# Altium schematic sheet BLOCK6.SchDoc
size A3; SheetNumber: 6; SheetTotal: 12
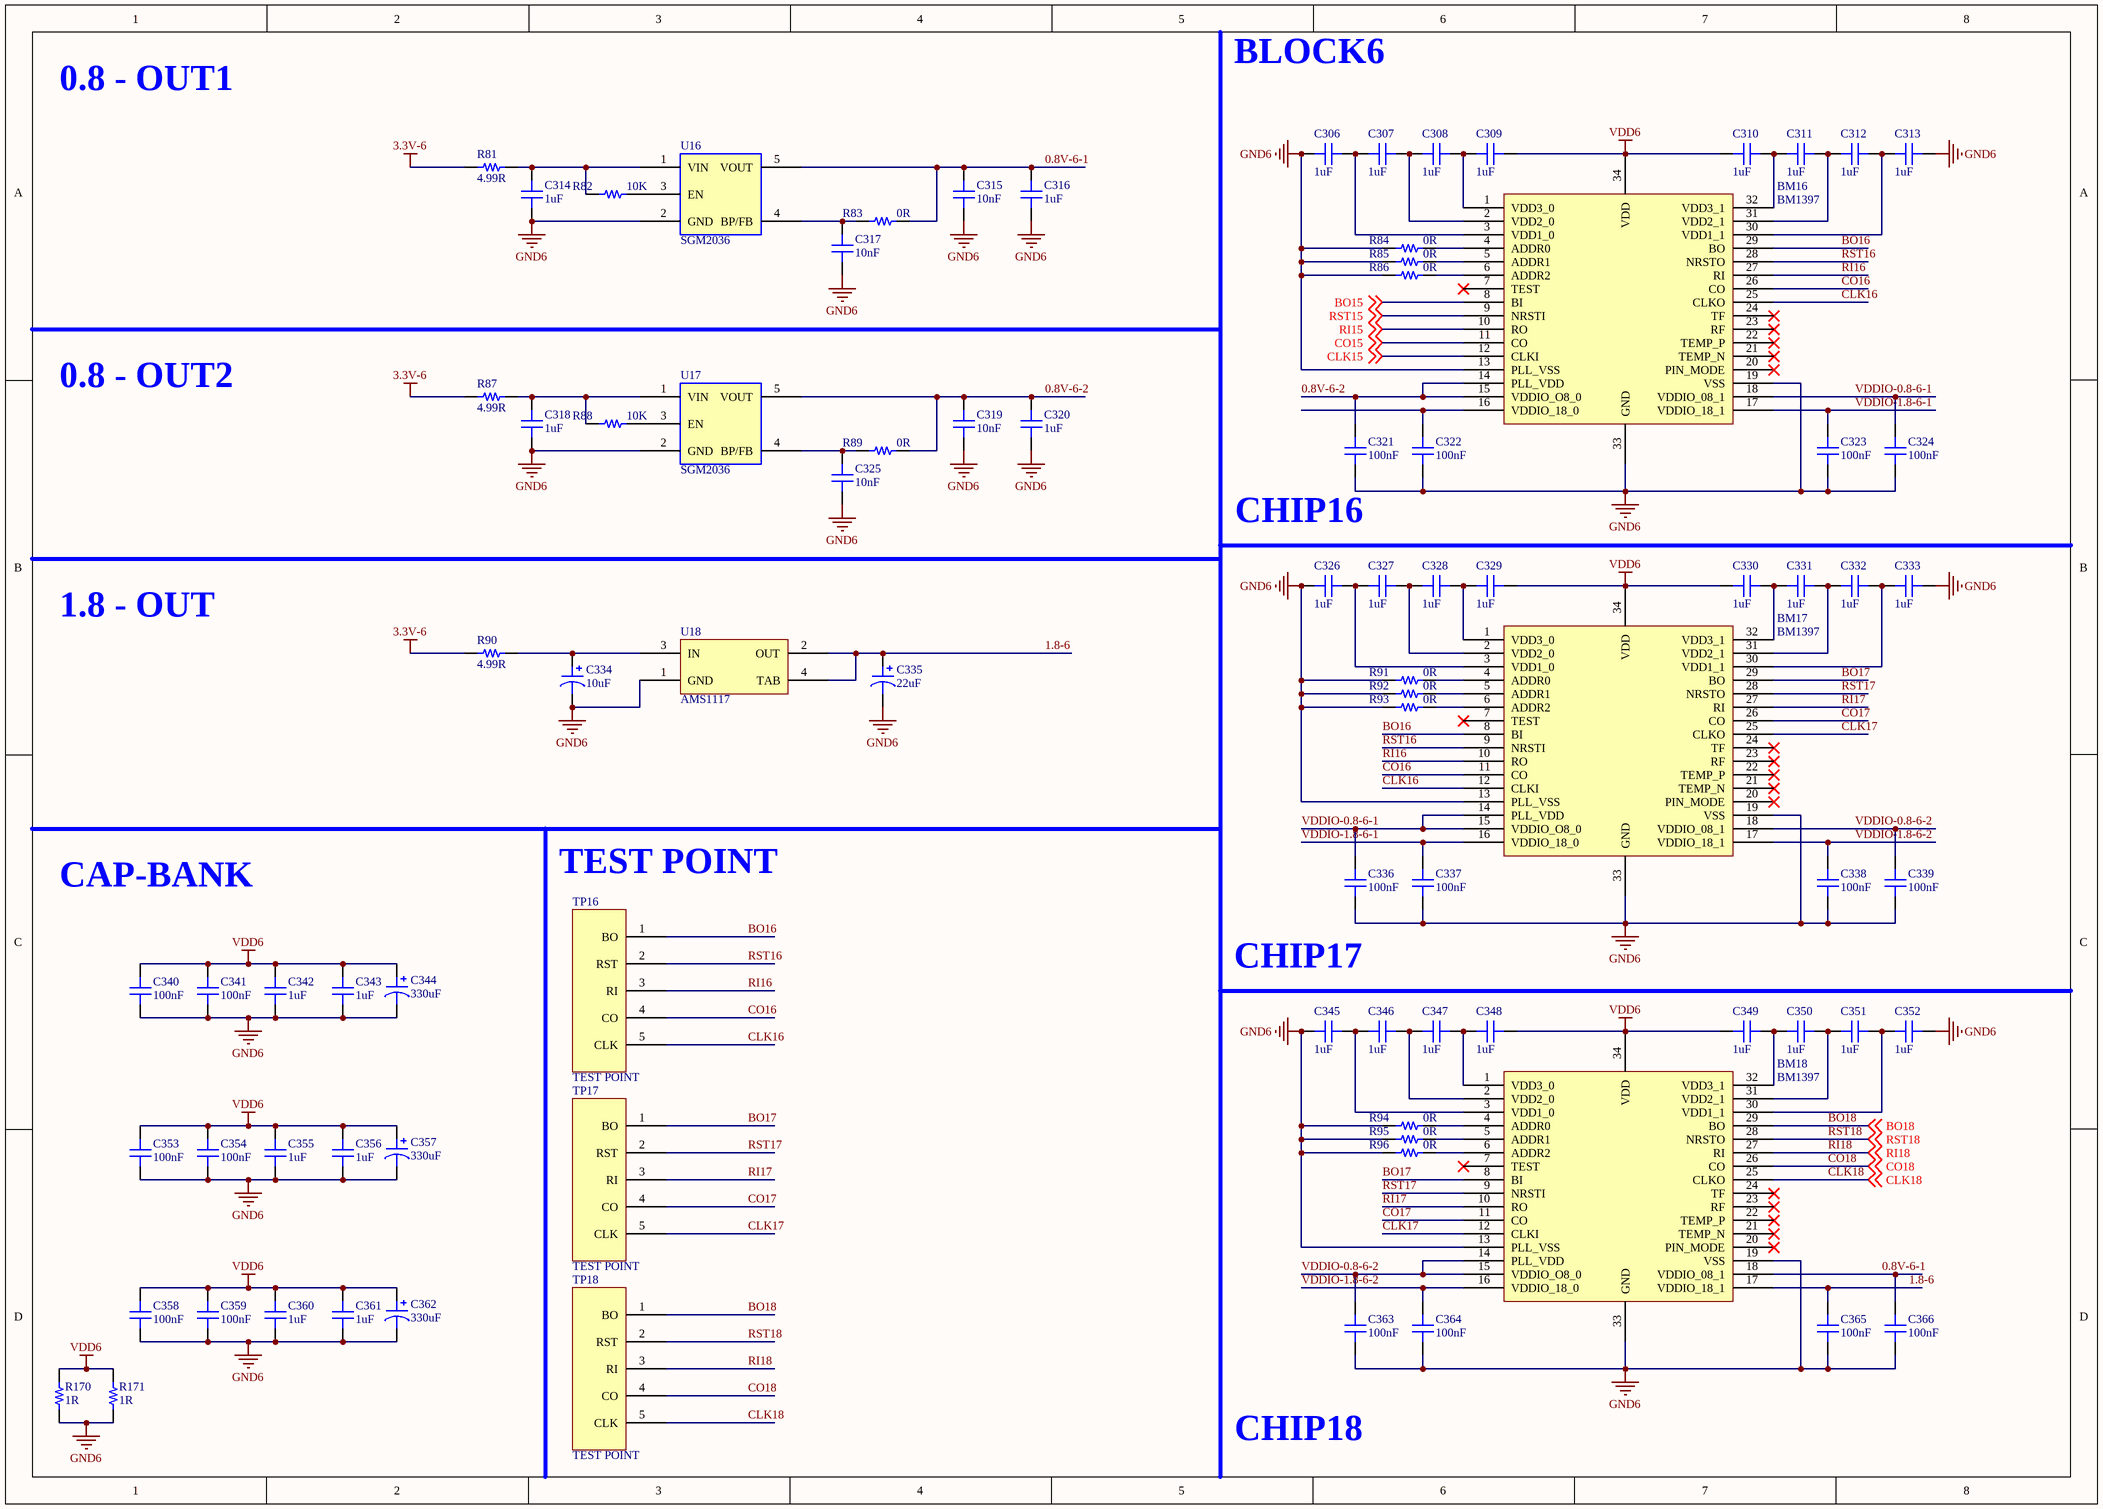
[diagram p0: BLOCK6.SchDoc]

## Parts
BM16  BM1397  [BM1387]
BM17  BM1397  [BM1387]
BM18  BM1397  [BM1387]
C306  1uF  [CAP-SMD-0603]
C307  1uF  [CAP-SMD-0603]
C308  1uF  [CAP-SMD-0603]
C309  1uF  [CAP-SMD-0603]
C310  1uF  [CAP-SMD-0603]
C311  1uF  [CAP-SMD-0603]
C312  1uF  [CAP-SMD-0603]
C313  1uF  [CAP-SMD-0603]
C314  1uF  [CAP_SMD_0805]
C315  10nF  [CAP_SMD_0805]
C316  1uF  [CAP_SMD_0805]
C317  10nF  [CAP_SMD_0805]
C318  1uF  [CAP_SMD_0805]
C319  10nF  [CAP_SMD_0805]
C320  1uF  [CAP_SMD_0805]
C321  100nF  [CAP_SMD_0805]
C322  100nF  [CAP_SMD_0805]
C323  100nF  [CAP_SMD_0805]
C324  100nF  [CAP_SMD_0805]
C325  10nF  [CAP_SMD_0805]
C326  1uF  [CAP-SMD-0603]
C327  1uF  [CAP-SMD-0603]
C328  1uF  [CAP-SMD-0603]
C329  1uF  [CAP-SMD-0603]
C330  1uF  [CAP-SMD-0603]
C331  1uF  [CAP-SMD-0603]
C332  1uF  [CAP-SMD-0603]
C333  1uF  [CAP-SMD-0603]
C334  10uF  [CAP-TAN-CASE-A]
C335  22uF  [CAP-TAN-CASE-A]
C336  100nF  [CAP_SMD_0805]
C337  100nF  [CAP_SMD_0805]
C338  100nF  [CAP_SMD_0805]
C339  100nF  [CAP_SMD_0805]
C340  100nF  [CAP_SMD_0805]
C341  100nF  [CAP_SMD_0805]
C342  1uF  [CAP_SMD_0805]
C343  1uF  [CAP_SMD_0805]
C344  330uF  [CAP-TAN-CASE-E]
C345  1uF  [CAP-SMD-0603]
C346  1uF  [CAP-SMD-0603]
C347  1uF  [CAP-SMD-0603]
C348  1uF  [CAP-SMD-0603]
C349  1uF  [CAP-SMD-0603]
C350  1uF  [CAP-SMD-0603]
C351  1uF  [CAP-SMD-0603]
C352  1uF  [CAP-SMD-0603]
C353  100nF  [CAP_SMD_0805]
C354  100nF  [CAP_SMD_0805]
C355  1uF  [CAP_SMD_0805]
C356  1uF  [CAP_SMD_0805]
C357  330uF  [CAP-TAN-CASE-E]
C358  100nF  [CAP_SMD_0805]
C359  100nF  [CAP_SMD_0805]
C360  1uF  [CAP_SMD_0805]
C361  1uF  [CAP_SMD_0805]
C362  330uF  [CAP-TAN-CASE-E]
C363  100nF  [CAP_SMD_0805]
C364  100nF  [CAP_SMD_0805]
C365  100nF  [CAP_SMD_0805]
C366  100nF  [CAP_SMD_0805]
R81  4.99R  [RES-SMD-1206]
R82  10K  [RES-SMD-0402]
R83  0R  [RES-SMD-0402]
R84  0R  [RES-SMD-0402]
R85  0R  [RES-SMD-0402]
R86  0R  [RES-SMD-0402]
R87  4.99R  [RES-SMD-1206]
R88  10K  [RES-SMD-0402]
R89  0R  [RES-SMD-0402]
R90  4.99R  [RES-SMD-1206]
R91  0R  [RES-SMD-0402]
R92  0R  [RES-SMD-0402]
R93  0R  [RES-SMD-0402]
R94  0R  [RES-SMD-0402]
R95  0R  [RES-SMD-0402]
R96  0R  [RES-SMD-0402]
R170  1R  [RES-SMD-1210]
R171  1R  [RES-SMD-1210]
TP16  TEST POINT  [TEST_POINT]
TP17  TEST POINT  [TEST_POINT]
TP18  TEST POINT  [TEST_POINT]
U16  SGM2036  [SOT23-5PIN]
U17  SGM2036  [SOT23-5PIN]
U18  AMS1117  [AMS1117]

## Nets
3.3V-6: R81.1 R87.1 R90.1
GND6: BM16.13(PLL_VSS) BM16.19(VSS) BM16.33(GND) BM17.13(PLL_VSS) BM17.19(VSS) BM17.33(GND) BM18.13(PLL_VSS) BM18.19(VSS) BM18.33(GND) C306.1 C313.2 C314.1 C315.1 C316.1 C317.1 C318.1 C319.1 C320.1 C321.1 C322.1 C323.1 C324.1 C325.1 C326.1 C333.2 C334.2 C335.2 C336.1 C337.1 C338.1 C339.1 C340.1 C341.1 C342.1 C343.1 C344.2 C345.1 C352.2 C353.1 C354.1 C355.1 C356.1 C357.2 C358.1 C359.1 C360.1 C361.1 C362.2 C363.1 C364.1 C365.1 C366.1 R84.1 R85.1 R86.1 R91.1 R92.1 R93.1 R94.1 R95.1 R96.1 R170.1 R171.1 U16.2(GND) U17.2(GND) U18.1(GND)
VDD6: BM16.34(VDD) BM17.34(VDD) BM18.34(VDD) C309.2 C310.1 C329.2 C330.1 C340.2 C341.2 C342.2 C343.2 C344.1 C348.2 C349.1 C353.2 C354.2 C355.2 C356.2 C357.1 C358.2 C359.2 C360.2 C361.2 C362.1 R170.2 R171.2
0.8V-6-1: BM18.18(VDDIO_08_1) C315.2 C316.2 C366.2 R83.2 U16.5(VOUT)
0.8V-6-2: BM16.14(PLL_VDD) BM16.15(VDDIO_O8_0) C319.2 C320.2 C321.2 R89.2 U17.5(VOUT)
1.8-6: BM18.17(VDDIO_18_1) C335.1 C365.2 U18.2(OUT) U18.4(TAB)
BO15: BM16.8(BI) ; off-sheet BO15
BO16: BM16.29(BO) BM17.8(BI) TP16.1(BO)
BO17: BM17.29(BO) BM18.8(BI) TP17.1(BO)
BO18: BM18.29(BO) TP18.1(BO) ; off-sheet BO18
CLK15: BM16.12(CLKI) ; off-sheet CLK15
CLK16: BM16.25(CLKO) BM17.12(CLKI) TP16.5(CLK)
CLK17: BM17.25(CLKO) BM18.12(CLKI) TP17.5(CLK)
CLK18: BM18.25(CLKO) TP18.5(CLK) ; off-sheet CLK18
CO15: BM16.11(CO) ; off-sheet CO15
CO16: BM16.26(CO) BM17.11(CO) TP16.4(CO)
CO17: BM17.26(CO) BM18.11(CO) TP17.4(CO)
CO18: BM18.26(CO) TP18.4(CO) ; off-sheet CO18
RI15: BM16.10(RO) ; off-sheet RI15
RI16: BM16.27(RI) BM17.10(RO) TP16.3(RI)
RI17: BM17.27(RI) BM18.10(RO) TP17.3(RI)
RI18: BM18.27(RI) TP18.3(RI) ; off-sheet RI18
RST15: BM16.9(NRSTI) ; off-sheet RST15
RST16: BM16.28(NRSTO) BM17.9(NRSTI) TP16.2(RST)
RST17: BM17.28(NRSTO) BM18.9(NRSTI) TP17.2(RST)
RST18: BM18.28(NRSTO) TP18.2(RST) ; off-sheet RST18
VDDIO-0.8-6-1: BM16.18(VDDIO_08_1) BM17.14(PLL_VDD) BM17.15(VDDIO_O8_0) C324.2 C336.2
VDDIO-0.8-6-2: BM17.18(VDDIO_08_1) BM18.14(PLL_VDD) BM18.15(VDDIO_O8_0) C339.2 C363.2
VDDIO-1.8-6-1: BM16.17(VDDIO_18_1) BM17.16(VDDIO_18_0) C323.2 C337.2
VDDIO-1.8-6-2: BM17.17(VDDIO_18_1) BM18.16(VDDIO_18_0) C338.2 C364.2
NetBM16_1: BM16.1(VDD3_0) C308.2 C309.1
NetBM16_2: BM16.2(VDD2_0) C307.2 C308.1
NetBM16_3: BM16.3(VDD1_0) C306.2 C307.1
NetBM16_4: BM16.4(ADDR0) R84.2
NetBM16_5: BM16.5(ADDR1) R85.2
NetBM16_6: BM16.6(ADDR2) R86.2
NetBM16_16: BM16.16(VDDIO_18_0) C322.2
NetBM16_30: BM16.30(VDD1_1) C312.2 C313.1
NetBM16_31: BM16.31(VDD2_1) C311.2 C312.1
NetBM16_32: BM16.32(VDD3_1) C310.2 C311.1
NetBM17_1: BM17.1(VDD3_0) C328.2 C329.1
NetBM17_2: BM17.2(VDD2_0) C327.2 C328.1
NetBM17_3: BM17.3(VDD1_0) C326.2 C327.1
NetBM17_4: BM17.4(ADDR0) R91.2
NetBM17_5: BM17.5(ADDR1) R92.2
NetBM17_6: BM17.6(ADDR2) R93.2
NetBM17_30: BM17.30(VDD1_1) C332.2 C333.1
NetBM17_31: BM17.31(VDD2_1) C331.2 C332.1
NetBM17_32: BM17.32(VDD3_1) C330.2 C331.1
NetBM18_1: BM18.1(VDD3_0) C347.2 C348.1
NetBM18_2: BM18.2(VDD2_0) C346.2 C347.1
NetBM18_3: BM18.3(VDD1_0) C345.2 C346.1
NetBM18_4: BM18.4(ADDR0) R94.2
NetBM18_5: BM18.5(ADDR1) R95.2
NetBM18_6: BM18.6(ADDR2) R96.2
NetBM18_30: BM18.30(VDD1_1) C351.2 C352.1
NetBM18_31: BM18.31(VDD2_1) C350.2 C351.1
NetBM18_32: BM18.32(VDD3_1) C349.2 C350.1
NetC314_2: C314.2 R81.2 R82.1 U16.1(VIN)
NetC317_2: C317.2 R83.1 U16.4(BP/FB)
NetC318_2: C318.2 R87.2 R88.1 U17.1(VIN)
NetC325_2: C325.2 R89.1 U17.4(BP/FB)
NetC334_1: C334.1 R90.2 U18.3(IN)
NetR82_2: R82.2 U16.3(EN)
NetR88_2: R88.2 U17.3(EN)

Not connected (* = marked no-connect by the designer): BM16 7(TEST)* 20(PIN_MODE)* 21(TEMP_N)* 22(TEMP_P)* 23(RF)* 24(TF)*; BM17 7(TEST)* 20(PIN_MODE)* 21(TEMP_N)* 22(TEMP_P)* 23(RF)* 24(TF)*; BM18 7(TEST)* 20(PIN_MODE)* 21(TEMP_N)* 22(TEMP_P)* 23(RF)* 24(TF)*

## Notes on the sheet
- 0.8 - OUT1
- BLOCK6
- 0.8 - OUT2
- (near C321) CHIP16
- 1.8 - OUT
- CAP-BANK
- TEST POINT
- CHIP17
- CHIP18

## Library data of the parts
BM16-BM18 = BM1397_1
C306-C333 C336-C343 C345-C356 C358-C361 C363-C366 = CAP
C334 C335 C344 C357 C362 = POLARIZED CAP
R81-R96 R170 R171 = RES